# Altium project XPIRL_1V0.PrjPCB
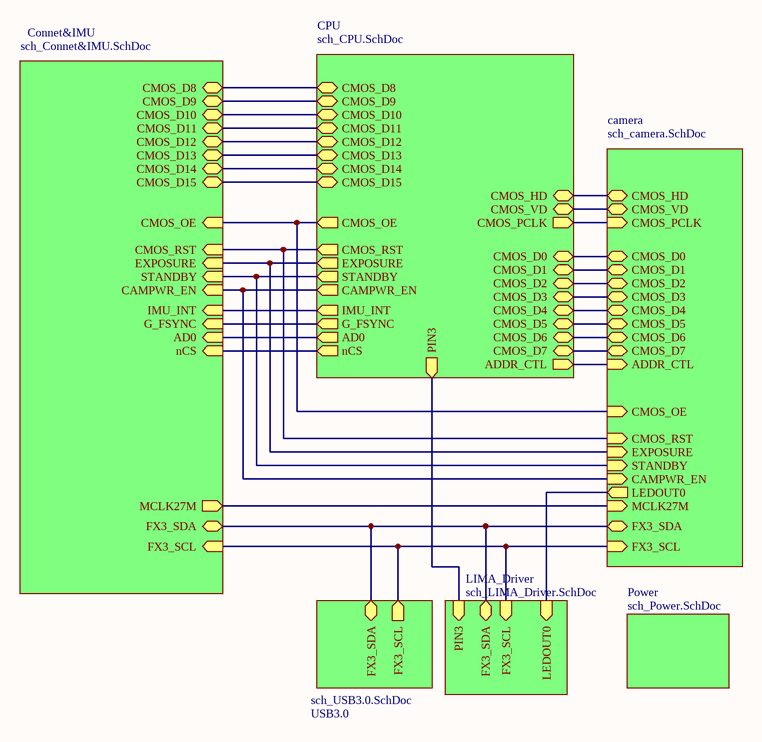
[diagram p0: sch_Top.SchDoc]
7 sheets, 227 parts. Net scope: hierarchical (ports join the sheet entries above them; power ports are global).
Sheets:
  sch_Top.SchDoc
    CPU = sch_CPU.SchDoc
    Connet&IMU = sch_Connet&IMU.SchDoc
    camera = sch_camera.SchDoc
    USB3.0 = sch_USB3.0.SchDoc
    Power = sch_Power.SchDoc
    LIMA_Driver = sch_LIMA_Driver.SchDoc

## Sheet sch_Top.SchDoc
size A4

### Sub-sheets
camera = sch_camera.SchDoc: CMOS_D0 (bidir), CMOS_D1 (bidir), CMOS_D2 (bidir), CMOS_D3 (bidir), CMOS_D4 (bidir), CMOS_D5 (bidir), CMOS_D6 (bidir), CMOS_D7 (bidir), CAMPWR_EN (in), CMOS_HD (bidir), CMOS_VD (bidir), CMOS_OE (in), CMOS_PCLK (in), CMOS_RST (in), EXPOSURE (in), STANDBY (in), ADDR_CTL (in), FX3_SCL (in), FX3_SDA (bidir), MCLK27M (in), LEDOUT0 (out)
Connet&IMU = sch_Connet&IMU.SchDoc: FX3_SCL (in), AD0 (in), nCS (in), STANDBY (in), EXPOSURE (in), CMOS_OE (in), CAMPWR_EN (in), CMOS_RST (in), FX3_SDA (bidir), CMOS_D8 (bidir), CMOS_D9 (bidir), CMOS_D10 (bidir), CMOS_D11 (bidir), CMOS_D12 (bidir), CMOS_D13 (bidir), CMOS_D14 (bidir), CMOS_D15 (bidir), IMU_INT (in), G_FSYNC (in), MCLK27M (out)
CPU = sch_CPU.SchDoc: AD0 (out), ADDR_CTL (out), CAMPWR_EN (out), CMOS_D0 (bidir), CMOS_D1 (bidir), CMOS_D2 (bidir), CMOS_D3 (bidir), CMOS_D4 (bidir), CMOS_D5 (bidir), CMOS_D6 (bidir), CMOS_D7 (bidir), CMOS_D8 (bidir), CMOS_D9 (bidir), CMOS_D10 (bidir), CMOS_D11 (bidir), CMOS_D12 (bidir), CMOS_D13 (bidir), CMOS_D14 (bidir), CMOS_D15 (bidir), CMOS_HD (bidir), CMOS_VD (bidir), CMOS_OE (out), CMOS_PCLK (out), CMOS_RST (out), EXPOSURE (out), IMU_INT (out), G_FSYNC (out), STANDBY (out), nCS (out), PIN3 (out)
LIMA_Driver = sch_LIMA_Driver.SchDoc: FX3_SDA (bidir), FX3_SCL (in), LEDOUT0 (in), PIN3 (in)
Power = sch_Power.SchDoc: no entries
USB3.0 = sch_USB3.0.SchDoc: FX3_SDA (bidir), FX3_SCL (out)

### Nets
AD0: sheet CPU/AD0, sheet Connet&IMU/AD0
ADDR_CTL: sheet CPU/ADDR_CTL, sheet camera/ADDR_CTL
CAMPWR_EN: sheet CPU/CAMPWR_EN, sheet Connet&IMU/CAMPWR_EN, sheet camera/CAMPWR_EN
CMOS_D0: sheet CPU/CMOS_D0, sheet camera/CMOS_D0
CMOS_D1: sheet CPU/CMOS_D1, sheet camera/CMOS_D1
CMOS_D2: sheet CPU/CMOS_D2, sheet camera/CMOS_D2
CMOS_D3: sheet CPU/CMOS_D3, sheet camera/CMOS_D3
CMOS_D4: sheet CPU/CMOS_D4, sheet camera/CMOS_D4
CMOS_D5: sheet CPU/CMOS_D5, sheet camera/CMOS_D5
CMOS_D6: sheet CPU/CMOS_D6, sheet camera/CMOS_D6
CMOS_D7: sheet CPU/CMOS_D7, sheet camera/CMOS_D7
CMOS_D8: sheet CPU/CMOS_D8, sheet Connet&IMU/CMOS_D8
CMOS_D9: sheet CPU/CMOS_D9, sheet Connet&IMU/CMOS_D9
CMOS_D10: sheet CPU/CMOS_D10, sheet Connet&IMU/CMOS_D10
CMOS_D11: sheet CPU/CMOS_D11, sheet Connet&IMU/CMOS_D11
CMOS_D12: sheet CPU/CMOS_D12, sheet Connet&IMU/CMOS_D12
CMOS_D13: sheet CPU/CMOS_D13, sheet Connet&IMU/CMOS_D13
CMOS_D14: sheet CPU/CMOS_D14, sheet Connet&IMU/CMOS_D14
CMOS_D15: sheet CPU/CMOS_D15, sheet Connet&IMU/CMOS_D15
CMOS_HD: sheet CPU/CMOS_HD, sheet camera/CMOS_HD
CMOS_OE: sheet CPU/CMOS_OE, sheet Connet&IMU/CMOS_OE, sheet camera/CMOS_OE
CMOS_PCLK: sheet CPU/CMOS_PCLK, sheet camera/CMOS_PCLK
CMOS_RST: sheet CPU/CMOS_RST, sheet Connet&IMU/CMOS_RST, sheet camera/CMOS_RST
CMOS_VD: sheet CPU/CMOS_VD, sheet camera/CMOS_VD
EXPOSURE: sheet CPU/EXPOSURE, sheet Connet&IMU/EXPOSURE, sheet camera/EXPOSURE
FX3_SCL: sheet Connet&IMU/FX3_SCL, sheet camera/FX3_SCL, sheet USB3.0/FX3_SCL, sheet LIMA_Driver/FX3_SCL
FX3_SDA: sheet Connet&IMU/FX3_SDA, sheet camera/FX3_SDA, sheet USB3.0/FX3_SDA, sheet LIMA_Driver/FX3_SDA
G_FSYNC: sheet CPU/G_FSYNC, sheet Connet&IMU/G_FSYNC
IMU_INT: sheet CPU/IMU_INT, sheet Connet&IMU/IMU_INT
LEDOUT0: sheet camera/LEDOUT0, sheet LIMA_Driver/LEDOUT0
MCLK27M: sheet Connet&IMU/MCLK27M, sheet camera/MCLK27M
nCS: sheet CPU/nCS, sheet Connet&IMU/nCS
PIN3: sheet CPU/PIN3, sheet LIMA_Driver/PIN3
STANDBY: sheet CPU/STANDBY, sheet Connet&IMU/STANDBY, sheet camera/STANDBY

## Sheet sch_CPU.SchDoc
size A4
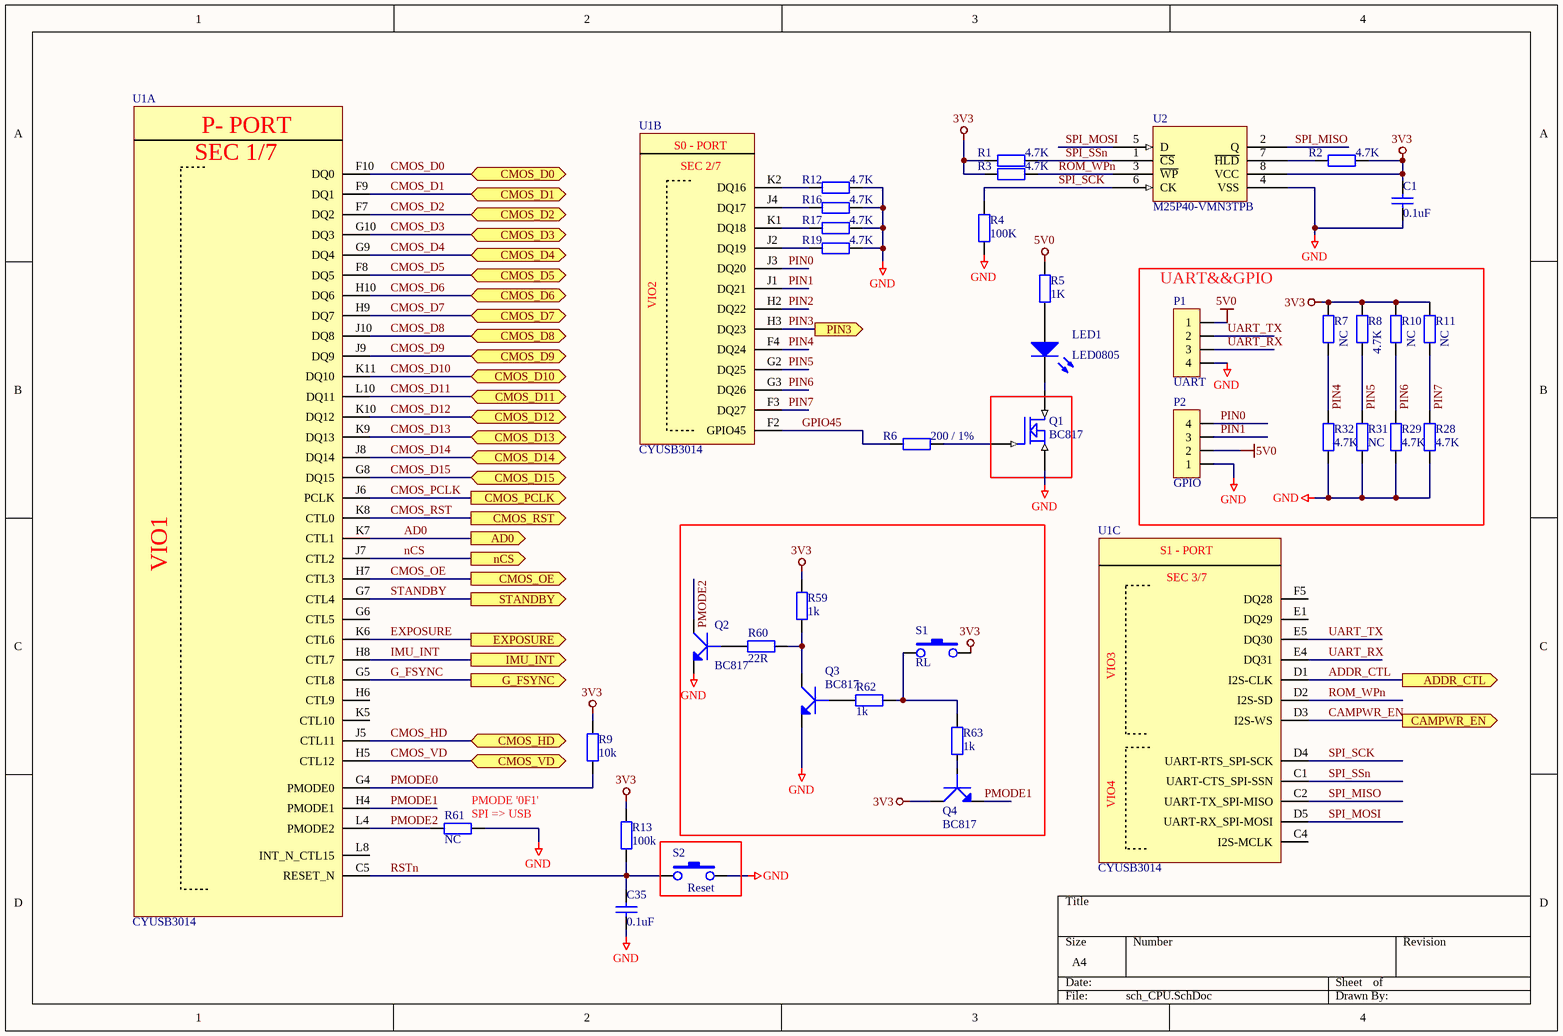
[diagram p1: sch_CPU.SchDoc]

### Parts
C1  0.1uF  [0402C]
C35  0.1uF  [0402C]
LED1  LED0805  [LED0805A_L210W100H60]
P1  UART  [WAFER4_P1.25L6.25W3.4H4.3]
P2  GPIO  [WAFER4_P1.25L6.25W3.4H4.3]
Q1  BC817  [SOT-23L]
Q2  BC817  [SOT-23L]
Q3  BC817  [SOT-23L]
Q4  BC817  [SOT-23L]
R1  4.7K  [0402R]
R2  4.7K  [0402R]
R3  4.7K  [0402R]
R4  100K  [0402R]
R5  1K  [0402R]
R6  value 200 / 1%  [0402R]  (hidden comment: 200R)
R7  NC  [0402R]
R8  4.7K  [0402R]
R9  10K  [0402R]
R10  NC  [0402R]
R11  NC  [0402R]
R12  4.7K  [0402R]
R13  100K  [0402R]
R16  4.7K  [0402R]
R17  4.7K  [0402R]
R19  4.7K  [0402R]
R28  4.7K  [0402R]
R29  4.7K  [0402R]
R31  value NC  [0402R]  (hidden comment: NC\)
R32  4.7K  [0402R]
R59  1K  [0402R]
R60  22R  [0402R]
R61  NC  [0805R]
R62  1k  [0402R]
R63  1k  [0402R]
S1  RL  [SW_L40W30H25_MPTFP]
S2  Reset  [SW_L40W30H25_MPTFP]
U1  CYUSB3014  [FBGA121_P80L100W100H11]  (parts A,B,C of 7)
U2  M25P40-VMN3TPB  [SO8N_P127L50W40W62H17]

### Blocks framed on the sheet
UART&&GPIO: P1 P2 R7 R8 R10 R11 R28 R29 R31 R32

### Ports
AD0 (out), ADDR_CTL (out), CAMPWR_EN (out), CMOS_D0 (bidir), CMOS_D1 (bidir), CMOS_D2 (bidir), CMOS_D3 (bidir), CMOS_D4 (bidir), CMOS_D5 (bidir), CMOS_D6 (bidir), CMOS_D7 (bidir), CMOS_D8 (bidir), CMOS_D9 (bidir), CMOS_D10 (bidir), CMOS_D11 (bidir), CMOS_D12 (bidir), CMOS_D13 (bidir), CMOS_D14 (bidir), CMOS_D15 (bidir), CMOS_HD (bidir), CMOS_OE (out), CMOS_PCLK (out), CMOS_RST (out), CMOS_VD (bidir), EXPOSURE (out), G_FSYNC (out), IMU_INT (out), nCS (out), PIN3 (out), STANDBY (out)

### Nets
3V3: C1.2 Q4.3(C) R1.1 R2.2 R3.1 R7.2 R8.2 R9.1 R10.2 R11.2 R13.1 R59.2 S1.1 U2.8(VCC)
5V0: P1.1 P2.2 R5.1
GND: C1.1 C35.1 P1.4 P2.1 Q1.2(S) Q2.2(E) Q3.2(E) R4.1 R12.2 R16.2 R17.2 R19.2 R28.2 R29.2 R31.2 R32.2 R61.1 S2.2 U2.4(VSS)
AD0: U1.K7(CTL1) ; port AD0
ADDR_CTL: U1.D1(I2S-CLK) ; port ADDR_CTL
CAMPWR_EN: U1.D3(I2S-WS) ; port CAMPWR_EN
CMOS_D0: U1.F10(DQ0) ; port CMOS_D0
CMOS_D1: U1.F9(DQ1) ; port CMOS_D1
CMOS_D2: U1.F7(DQ2) ; port CMOS_D2
CMOS_D3: U1.G10(DQ3) ; port CMOS_D3
CMOS_D4: U1.G9(DQ4) ; port CMOS_D4
CMOS_D5: U1.F8(DQ5) ; port CMOS_D5
CMOS_D6: U1.H10(DQ6) ; port CMOS_D6
CMOS_D7: U1.H9(DQ7) ; port CMOS_D7
CMOS_D8: U1.J10(DQ8) ; port CMOS_D8
CMOS_D9: U1.J9(DQ9) ; port CMOS_D9
CMOS_D10: U1.K11(DQ10) ; port CMOS_D10
CMOS_D11: U1.L10(DQ11) ; port CMOS_D11
CMOS_D12: U1.K10(DQ12) ; port CMOS_D12
CMOS_D13: U1.K9(DQ13) ; port CMOS_D13
CMOS_D14: U1.J8(DQ14) ; port CMOS_D14
CMOS_D15: U1.G8(DQ15) ; port CMOS_D15
CMOS_HD: U1.J5(CTL11) ; port CMOS_HD
CMOS_OE: U1.H7(CTL3) ; port CMOS_OE
CMOS_PCLK: U1.J6(PCLK) ; port CMOS_PCLK
CMOS_RST: U1.K8(CTL0) ; port CMOS_RST
CMOS_VD: U1.H5(CTL12) ; port CMOS_VD
EXPOSURE: U1.K6(CTL6) ; port EXPOSURE
G_FSYNC: U1.G5(CTL8) ; port G_FSYNC
GPIO45: R6.1 U1.F2(GPIO45)
IMU_INT: U1.H8(CTL7) ; port IMU_INT
nCS: U1.J7(CTL2) ; port nCS
PIN0: P2.4 U1.J3(DQ20)
PIN1: P2.3 U1.J1(DQ21)
PIN2: U1.H2(DQ22)
PIN3: U1.H3(DQ23) ; port PIN3
PIN4: R7.1 R32.1 U1.F4(DQ24)
PIN5: R8.1 R31.1 U1.G2(DQ25)
PIN6: R10.1 R29.1 U1.G3(DQ26)
PIN7: R11.1 R28.1 U1.F3(DQ27)
PMODE0: R9.2 U1.G4(PMODE0)
PMODE1: Q4.2(E) U1.H4(PMODE1)
PMODE2: Q2.3(C) R61.2 U1.L4(PMODE2)
ROM_WPn: R3.2 U1.D2(I2S-SD) U2.3(~{WP})
RSTn: C35.2 R13.2 S2.1 U1.C5(RESET_N)
SPI_MISO: U1.C2(UART-TX_SPI-MISO) U2.2(Q)
SPI_MOSI: U1.D5(UART-RX_SPI-MOSI) U2.5(D)
SPI_SCK: R4.2 U1.D4(UART-RTS_SPI-SCK) U2.6(CK)
SPI_SSn: R1.2 U1.C1(UART-CTS_SPI-SSN) U2.1(~{CS})
STANDBY: U1.G7(CTL4) ; port STANDBY
UART_RX: P1.3 U1.E4(DQ31)
UART_TX: P1.2 U1.E5(DQ30)
NetLED1_1: LED1.1(A) R5.2
NetLED1_2: LED1.2(K) Q1.3(D)
NetQ1_1: Q1.1(G) R6.2
NetQ2_1: Q2.1(B) R60.1
NetQ3_1: Q3.1(B) R62.2
NetQ3_3: Q3.3(C) R59.1 R60.2
NetQ4_1: Q4.1(B) R63.2
NetR2_1: R2.1 U2.7(~{HLD})
NetR12_1: R12.1 U1.K2(DQ16)
NetR16_1: R16.1 U1.J4(DQ17)
NetR17_1: R17.1 U1.K1(DQ18)
NetR19_1: R19.1 U1.J2(DQ19)
NetR62_1: R62.1 R63.1 S1.2

Not connected (* = marked no-connect by the designer): U1 C4(I2S-MCLK) E1(DQ29) F5(DQ28) G6(CTL5) H6(CTL9) K5(CTL10) L8(INT_N_CTL15)

### Notes on the sheet
- (near R61) PMODE '0F1'
- (near R61) SPI => USB
- (in symbol CYUSB3014, part A) P- PORT; SEC 1/7; VIO1
- (in symbol CYUSB3014, part B) S0 - PORT; SEC 2/7
- (in symbol CYUSB3014, part C) S1 - PORT; SEC 3/7

### Library data of the parts
C1 C35 = Cap: Capacitor; Published: 8-Jun-2000; LatestRevisionDate: 17-Jul-2002; LatestRevisionNote: Re-released for DXP Platform.; PackageReference: RAD-0.3; Publisher: Altium Limited; Value: 0.1uF
LED1 = LED: 发光二级管
P1 P2 = CON4
Q1 = MOSFET N
Q2-Q4 = NPN: NPN Transistor
R1-R13 R16 R17 R19 R28 R29 R31 R32 R59 R61-R63 = Resistor: Published: 8-Jun-2000; LatestRevisionDate: 17-Jul-2002; LatestRevisionNote: Re-released for DXP Platform.; PackageReference: AXIAL-0.4; Publisher: Altium Limited
  R1-R3 R8 R12 R16 R17 R19 R28 R29 R32: Value: 4.7K
  R4: Value: 100K
  R5: Value: 1K
  R7 R10 R11 R61: Value: NC
  R9: Value: 10k
  R13: Value: 100k
  R59 R62 R63: Value: 1k
R60 = Resistor: Value: 10k; Published: 8-Jun-2000; LatestRevisionDate: 17-Jul-2002; LatestRevisionNote: Re-released for DXP Platform.; PackageReference: AXIAL-0.4; Publisher: Altium Limited
S1 S2 = Button_sop: Value: BUTTON

## Sheet sch_Connet&IMU.SchDoc
size A4
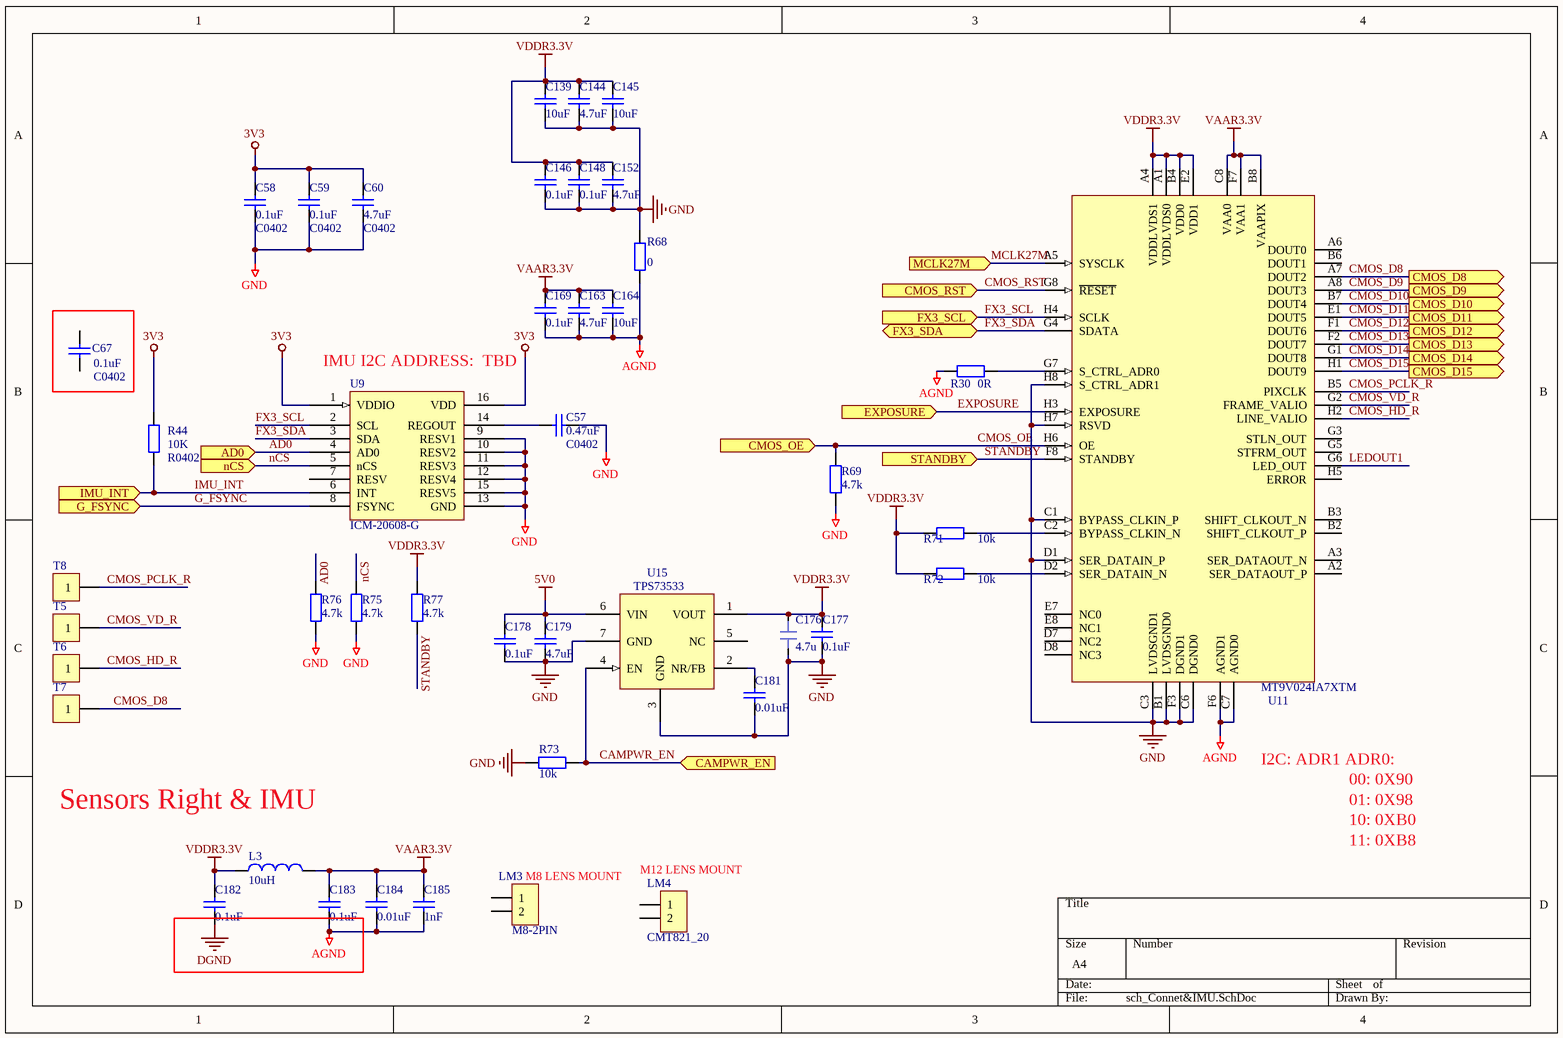
[diagram p2: sch_Connet&IMU.SchDoc]

### Parts
C57  0.47uF  value C0402  [0402C]
C58  0.1uF  value C0402  [0402C]
C59  0.1uF  value C0402  [0402C]
C60  4.7uF  value C0402  [0402C]
C67  0.1uF  value C0402  [0402C]
C139  10uF  [0805C]
C144  4.7uF  [0402C]
C145  10uF  [0805C]
C146  0.1uF  [0402C]
C148  0.1uF  [0402C]
C152  4.7uF  [0402C]
C163  4.7uF  [0402C]
C164  10uF  [0805C]
C169  0.1uF  [0402C]
C176  4.7u  [0402C_L]
C177  0.1uF  [0402C_L]
C178  0.1uF  [0402C]
C179  4.7uF  [0402C_L]
C181  0.01uF  [0402C_L]
C182  0.1uF  [0402C_L]
C183  0.1uF  [0402C_L]
C184  0.01uF  [0402C_L]
C185  1nF  [0402C_L]
L3  10uH  [0805R]
LM3  M8-2PIN  [PAD_M3_D350_450]
LM4  CMT821_20  [PAD_M3_D350_450]
R30  0R  [0402R]
R44  10K  value R0402  [0402R]
R68  value 0  [0402R]  (hidden comment: 0R)
R69  4.7K  [0402R_L]
R71  10K  [0402R]
R72  10K  [0402R]
R73  10K  [0402R_L]
R75  4.7K  [0402R]
R76  4.7K  [0402R]
R77  4.7K  [0402R]
T5  CON1  [PAD_TP_D1.2]  (value not drawn)
T6  CON1  [PAD_TP_D1.2]  (value not drawn)
T7  CON1  [PAD_TP_D1.2]  (value not drawn)
T8  CON1  [PAD_TP_D1.2]  (value not drawn)
U9  ICM-20608-G  [LGA16_P50L30W30H08]
U11  MT9V024IA7XTM  [IBGA52_8X8_P100L90W90H90R]
U15  TPS73533  [SON6_P65L21W21H8_DRV]

### Ports
AD0 (in), CAMPWR_EN (in), CMOS_D8 (out), CMOS_D9 (out), CMOS_D10 (out), CMOS_D11 (out), CMOS_D12 (out), CMOS_D13 (out), CMOS_D14 (out), CMOS_D15 (out), CMOS_OE (in), CMOS_RST (in), EXPOSURE (in), FX3_SCL (in), FX3_SDA (bidir), G_FSYNC (in), IMU_INT (in), MCLK27M (in), nCS (in), STANDBY (in)

### Nets
3V3: C58.2 C59.2 C60.2 R44.2 U9.1(VDDIO) U9.16(VDD)
5V0: C178.2 C179.2 U15.6(VIN)
AGND: C163.1 C164.1 C169.1 C183.1 C184.1 C185.1 R30.2 R68.2 U11.C7(AGND0) U11.F6(AGND1)
DGND: C182.1
GND: C57.1 C58.1 C59.1 C60.1 C139.1 C144.1 C145.1 C146.1 C148.1 C152.1 C176.2 C177.1 C178.1 C179.1 C181.1 R68.1 R69.1 R73.1 R75.1 R76.1 U9.9(RESV1) U9.10(RESV2) U9.11(RESV3) U9.12(RESV4) U9.13(GND) U9.15(RESV5) U11.B1(LVDSGND0) U11.C1(BYPASS_CLKIN_P) U11.C3(LVDSGND1) U11.C6(DGND0) U11.D1(SER_DATAIN_P) U11.F3(DGND1) U11.H7(RSVD) U11.H8(S_CTRL_ADR1) U15.3(GND) U15.7(GND)
VAAR3.3V: C163.2 C164.2 C169.2 C183.2 C184.2 C185.2 L3.2 U11.B8(VAAPIX) U11.C8(VAA0) U11.F7(VAA1)
VDDR3.3V: C139.2 C144.2 C145.2 C146.2 C148.2 C152.2 C176.1 C177.2 C182.2 L3.1 R71.2 R72.2 R77.2 U11.A1(VDDLVDS0) U11.A4(VDDLVDS1) U11.B4(VDD0) U11.E2(VDD1) U15.1(VOUT)
AD0: R76.2 U9.4(AD0) ; port AD0
CAMPWR_EN: R73.2 U15.4(EN) ; port CAMPWR_EN
CMOS_D8: T7.1 U11.A7(DOUT2) ; port CMOS_D8
CMOS_D9: U11.A8(DOUT3) ; port CMOS_D9
CMOS_D10: U11.B7(DOUT4) ; port CMOS_D10
CMOS_D11: U11.E1(DOUT5) ; port CMOS_D11
CMOS_D12: U11.F1(DOUT6) ; port CMOS_D12
CMOS_D13: U11.F2(DOUT7) ; port CMOS_D13
CMOS_D14: U11.G1(DOUT8) ; port CMOS_D14
CMOS_D15: U11.H1(DOUT9) ; port CMOS_D15
CMOS_HD_R: T6.1 U11.H2(LINE_VALIO)
CMOS_OE: R69.2 U11.H6(OE) ; port CMOS_OE
CMOS_PCLK_R: T8.1 U11.B5(PIXCLK)
CMOS_RST: U11.G8(~{RESET}) ; port CMOS_RST
CMOS_VD_R: T5.1 U11.G2(FRAME_VALIO)
EXPOSURE: U11.H3(EXPOSURE) ; port EXPOSURE
FX3_SCL: U9.2(SCL) U11.H4(SCLK) ; port FX3_SCL
FX3_SDA: U9.3(SDA) U11.G4(SDATA) ; port FX3_SDA
G_FSYNC: U9.8(FSYNC) ; port G_FSYNC
IMU_INT: R44.1 U9.6(INT) ; port IMU_INT
LEDOUT1: U11.G6(LED_OUT)
MCLK27M: U11.A5(SYSCLK) ; port MCLK27M
nCS: R75.2 U9.5(nCS) ; port nCS
STANDBY: R77.1 U11.F8(STANDBY) ; port STANDBY
NetC57_2: C57.2 U9.14(REGOUT)
NetC181_2: C181.2 U15.2(NR/FB)
NetR30_1: R30.1 U11.G7(S_CTRL_ADR0)
NetR71_1: R71.1 U11.C2(BYPASS_CLKIN_N)
NetR72_1: R72.1 U11.D2(SER_DATAIN_N)

Not connected (* = marked no-connect by the designer): C67 1 2; LM3 1 2; LM4 1 2; U9 7(RESV); U11 A2(SER_DATAOUT_P) A3(SER_DATAOUT_N) A6(DOUT0) B2(SHIFT_CLKOUT_P) B3(SHIFT_CLKOUT_N) B6(DOUT1) D7(NC2) D8(NC3) E7(NC0) E8(NC1) G3(STLN_OUT) G5(STFRM_OUT) H5(ERROR); U15 5(NC)

### Notes on the sheet
- (near U9) IMU I2C ADDRESS:  TBD
- I2C: ADR1 ADR0:
- 00: 0X90
- Sensors Right & IMU
- 01: 0X98
- 10: 0XB0
- 11: 0XB8
- (near LM3) M8 LENS MOUNT
- (near LM4) M12 LENS MOUNT

### Library data of the parts
C57-C60 C67 C139 C144-C146 C148 C152 C163 C164 C169 C177-C179 C181-C185 = Cap: Capacitor; Published: 8-Jun-2000; LatestRevisionDate: 17-Jul-2002; LatestRevisionNote: Re-released for DXP Platform.; Publisher: Altium Limited
  C57-C60 C67: PackageReference: RAD-0.3
  C139 C145 C164: PackageReference: RAD-0.3; Value: 10uF
  C144 C152 C163 C179: PackageReference: RAD-0.3; Value: 4.7uF
  C146 C148 C169 C177 C178 C182 C183: Value: 0.1uF
  C181: PackageReference: RAD-0.3; Value: 0.01uF
  C184: Value: 0.01uF
  C185: Value: 1nF
C176 = cap0402: CC0402MRX5R5BB475; 元件类别: 贴片电容; 主物料厂家: YAGEO
L3 = Inductor: Value: 330mH
LM3 LM4 = CON2: Connector
R30 R44 = Res2: Resistor; Published: 8-Jun-2000; LatestRevisionDate: 17-Jul-2002; LatestRevisionNote: Re-released for DXP Platform.; PackageReference: AXIAL-0.4; Publisher: Altium Limited
  R30: Value: 0R
R68 R69 R71-R73 R75-R77 = Resistor: Published: 8-Jun-2000; LatestRevisionDate: 17-Jul-2002; LatestRevisionNote: Re-released for DXP Platform.; PackageReference: AXIAL-0.4; Publisher: Altium Limited
  R69 R75-R77: Value: 4.7k
  R71-R73: Value: 10k
T5-T8 = CON1: Connector

## Sheet sch_camera.SchDoc
size A4
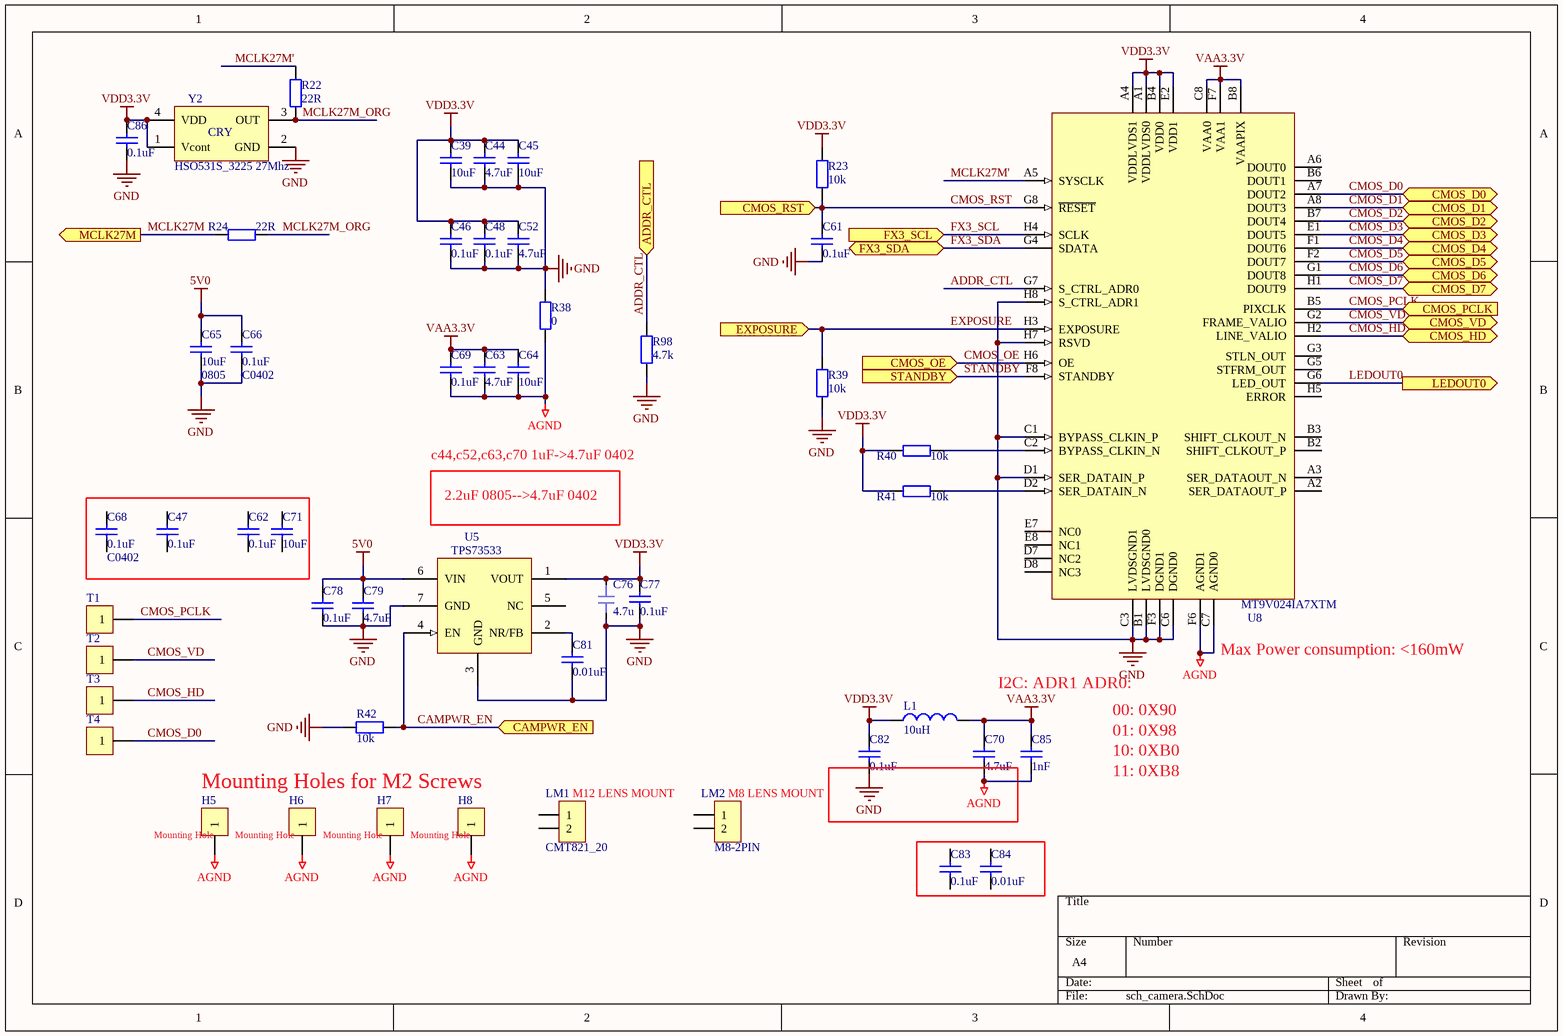
[diagram p3: sch_camera.SchDoc]

### Parts
C39  10uF  [0805C]
C44  4.7uF  [0402C]
C45  10uF  [0805C]
C46  0.1uF  [0402C]
C47  0.1uF  [0402C]
C48  0.1uF  [0402C]
C52  4.7uF  [0402C]
C61  0.1uF  [0402C_L]
C62  0.1uF  [0402C]
C63  4.7uF  [0402C]
C64  10uF  [0805C]
C65  10uF  value 0805  [0805C]
C66  0.1uF  value C0402  [0402C]
C68  0.1uF  value C0402  [0402C]
C69  0.1uF  [0402C]
C70  4.7uF  [0402C]
C71  10uF  [0805C]
C76  4.7u  [0402C_L]
C77  0.1uF  [0402C_L]
C78  0.1uF  [0402C]
C79  value 4.7uF  [0402C_L]  (hidden comment: 1uF)
C81  0.01uF  [0402C_L]
C82  0.1uF  [0402C_L]
C83  0.1uF  [0402C_L]
C84  0.01uF  [0402C_L]
C85  1nF  [0402C_L]
C86  0.1uF  [0402C_L]
H5  CON1  [PAD_M3_D350_450]  (value not drawn)
H6  CON1  [PAD_M3_D350_450]  (value not drawn)
H7  CON1  [PAD_M3_D350_450]  (value not drawn)
H8  CON1  [PAD_M3_D350_450]  (value not drawn)
L1  10uH  [0805R]
LM1  CMT821_20  [PAD_M3_D350_450]
LM2  M8-2PIN  [PAD_M3_D350_450]
R22  value 22R  [0402R_L]  (hidden comment: 0R)
R23  10K  [0402R_L]
R24  22R  [0402R]
R38  value 0  [0402R]  (hidden comment: 0R)
R39  10K  [0402R_L]
R40  10K  [0402R_L]
R41  10K  [0402R_L]
R42  10K  [0402R_L]
R98  4.7K  [0402R_L]
T1  CON1  [PAD_TP_D1.2]  (value not drawn)
T2  CON1  [PAD_TP_D1.2]  (value not drawn)
T3  CON1  [PAD_TP_D1.2]  (value not drawn)
T4  CON1  [PAD_TP_D1.2]  (value not drawn)
U5  TPS73533  [SON6_P65L21W21H8_DRV]
U8  MT9V024IA7XTM  [IBGA52_8X8_P100L90W90H90R]
Y2  HSO531S_3225 27Mhz  [XTAL_3225]

### Ports
ADDR_CTL (in), CAMPWR_EN (in), CMOS_D0 (bidir), CMOS_D1 (bidir), CMOS_D2 (bidir), CMOS_D3 (bidir), CMOS_D4 (bidir), CMOS_D5 (bidir), CMOS_D6 (bidir), CMOS_D7 (bidir), CMOS_HD (bidir), CMOS_OE (in), CMOS_PCLK (in), CMOS_RST (in), CMOS_VD (bidir), EXPOSURE (in), FX3_SCL (in), FX3_SDA (bidir), LEDOUT0 (out), MCLK27M (out), STANDBY (in)

### Nets
5V0: C65.2 C66.2 C78.2 C79.2 U5.6(VIN)
AGND: C63.1 C64.1 C69.1 C70.1 C85.1 H5.1 H6.1 H7.1 H8.1 R38.2 U8.C7(AGND0) U8.F6(AGND1)
GND: C39.1 C44.1 C45.1 C46.1 C48.1 C52.1 C61.1 C65.1 C66.1 C76.2 C77.1 C78.1 C79.1 C81.1 C82.1 C86.1 R38.1 R39.2 R42.2 R98.1 U5.3(GND) U5.7(GND) U8.B1(LVDSGND0) U8.C1(BYPASS_CLKIN_P) U8.C3(LVDSGND1) U8.C6(DGND0) U8.D1(SER_DATAIN_P) U8.F3(DGND1) U8.H7(RSVD) U8.H8(S_CTRL_ADR1) Y2.2(GND)
VAA3.3V: C63.2 C64.2 C69.2 C70.2 C85.2 L1.2 U8.B8(VAAPIX) U8.C8(VAA0) U8.F7(VAA1)
VDD3.3V: C39.2 C44.2 C45.2 C46.2 C48.2 C52.2 C76.1 C77.2 C82.2 C86.2 L1.1 R23.2 R40.2 R41.2 U5.1(VOUT) U8.A1(VDDLVDS0) U8.A4(VDDLVDS1) U8.B4(VDD0) U8.E2(VDD1) Y2.1(Vcont) Y2.4(VDD)
ADDR_CTL: R98.2 U8.G7(S_CTRL_ADR0) ; port ADDR_CTL
CAMPWR_EN: R42.1 U5.4(EN) ; port CAMPWR_EN
CMOS_D0: T4.1 U8.A7(DOUT2) ; port CMOS_D0
CMOS_D1: U8.A8(DOUT3) ; port CMOS_D1
CMOS_D2: U8.B7(DOUT4) ; port CMOS_D2
CMOS_D3: U8.E1(DOUT5) ; port CMOS_D3
CMOS_D4: U8.F1(DOUT6) ; port CMOS_D4
CMOS_D5: U8.F2(DOUT7) ; port CMOS_D5
CMOS_D6: U8.G1(DOUT8) ; port CMOS_D6
CMOS_D7: U8.H1(DOUT9) ; port CMOS_D7
CMOS_HD: T3.1 U8.H2(LINE_VALIO) ; port CMOS_HD
CMOS_OE: U8.H6(OE) ; port CMOS_OE
CMOS_PCLK: T1.1 U8.B5(PIXCLK) ; port CMOS_PCLK
CMOS_RST: C61.2 R23.1 U8.G8(~{RESET}) ; port CMOS_RST
CMOS_VD: T2.1 U8.G2(FRAME_VALIO) ; port CMOS_VD
EXPOSURE: R39.1 U8.H3(EXPOSURE) ; port EXPOSURE
FX3_SCL: U8.H4(SCLK) ; port FX3_SCL
FX3_SDA: U8.G4(SDATA) ; port FX3_SDA
LEDOUT0: U8.G6(LED_OUT) ; port LEDOUT0
MCLK27M: R24.1 ; port MCLK27M
MCLK27M': R22.1 U8.A5(SYSCLK)
MCLK27M_ORG: R22.2 R24.2 Y2.3(OUT)
STANDBY: U8.F8(STANDBY) ; port STANDBY
NetC81_2: C81.2 U5.2(NR/FB)
NetR40_1: R40.1 U8.C2(BYPASS_CLKIN_N)
NetR41_1: R41.1 U8.D2(SER_DATAIN_N)

Not connected (* = marked no-connect by the designer): C47 1 2; C62 1 2; C68 1 2; C71 1 2; C83 1 2; C84 1 2; LM1 1 2; LM2 1 2; U5 5(NC); U8 A2(SER_DATAOUT_P) A3(SER_DATAOUT_N) A6(DOUT0) B2(SHIFT_CLKOUT_P) B3(SHIFT_CLKOUT_N) B6(DOUT1) D7(NC2) D8(NC3) E7(NC0) E8(NC1) G3(STLN_OUT) G5(STFRM_OUT) H5(ERROR)

### Notes on the sheet
- c44,c52,c63,c70 1uF->4.7uF 0402
- 2.2uF 0805-->4.7uF 0402
- (near U8) Max Power consumption: <160mW
- I2C: ADR1 ADR0:
- 00: 0X90
- Mounting Holes for M2 Screws
- 01: 0X98
- 10: 0XB0
- 11: 0XB8
- (near H5) Mounting Hole
- (near H6) Mounting Hole
- (near H7) Mounting Hole
- (near H8) Mounting Hole
- (near LM1) M12 LENS MOUNT
- (near LM2) M8 LENS MOUNT

### Library data of the parts
C39 C44-C48 C52 C61-C66 C68-C71 C77-C79 C81-C86 = Cap: Capacitor; Published: 8-Jun-2000; LatestRevisionDate: 17-Jul-2002; LatestRevisionNote: Re-released for DXP Platform.; Publisher: Altium Limited
  C39 C45 C64 C71: PackageReference: RAD-0.3; Value: 10uF
  C44 C52 C63 C70: PackageReference: RAD-0.3; Value: 4.7uF
  C46-C48 C61 C62 C69 C77 C78 C82 C83 C86: Value: 0.1uF
  C65 C79: PackageReference: RAD-0.3
  C81: PackageReference: RAD-0.3; Value: 0.01uF
  C84: Value: 0.01uF
  C85: Value: 1nF
C76 = cap0402: as C176 on sheet sch_Connet&IMU
H5-H8 T1-T4 = CON1: Connector
L1 = Inductor: Value: 330mH
LM1 LM2 = CON2: Connector
R22-R24 R38-R42 R98 = Resistor: Published: 8-Jun-2000; LatestRevisionDate: 17-Jul-2002; LatestRevisionNote: Re-released for DXP Platform.; PackageReference: AXIAL-0.4; Publisher: Altium Limited
  R23 R39-R42: Value: 10k
  R24: Value: 22R
  R98: Value: 4.7k
Y2 = CRY: 有源晶振

## Sheet sch_USB3.0.SchDoc
size A4
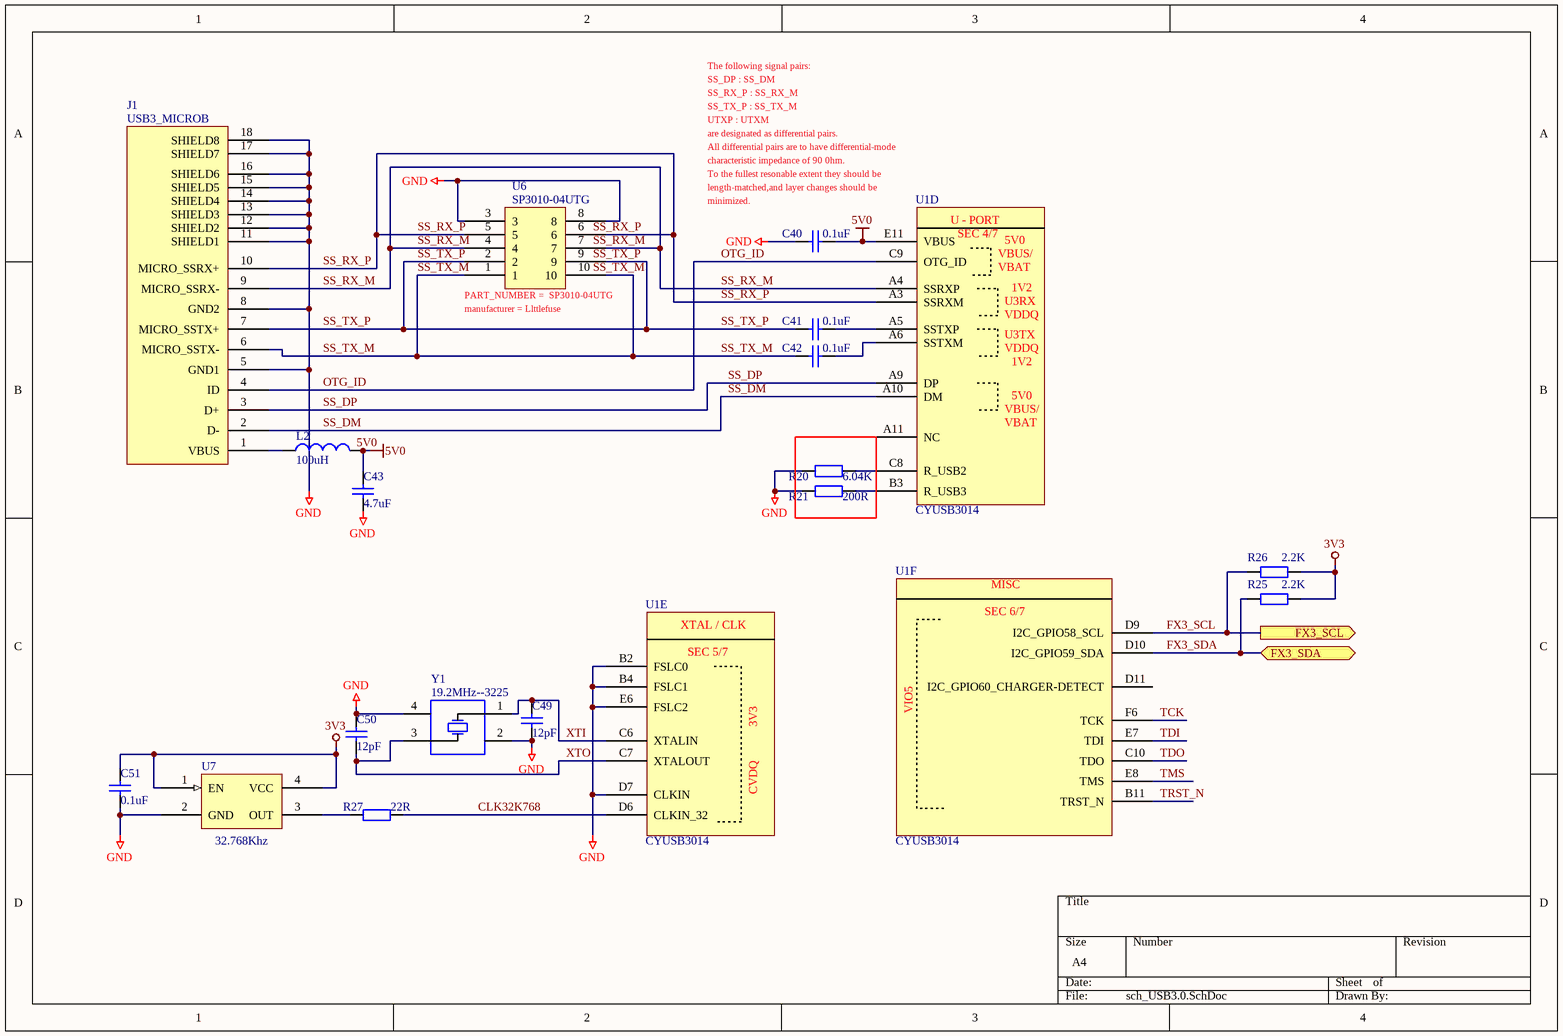
[diagram p4: sch_USB3.0.SchDoc]

### Parts
C40  0.1uF  [0402C]
C41  0.1uF  [0402C]
C42  0.1uF  [0402C]
C43  4.7uF
C49  12pF  [0402C]
C50  12pF  [0402C]
C51  0.1uF  [0402C]
J1  USB3_MICROB  [USB3_BA_P65L130W51H28]
L2  100uH
R20  6.04K  [0402R]
R21  200R  [0402R]
R25  2.2K  [0402R]
R26  2.2K  [0402R]
R27  22R  [0402R]
U1  CYUSB3014  [FBGA121_P80L100W100H11]  (parts D,E,F of 7)
U6  SP3010-04UTG  [UDFN10_SON_P50L25W10H55]
U7  XTAL-3225  [XTAL_3225]  (value not drawn)
Y1  19.2MHz--3225  [XTAL_3225]

### Ports
FX3_SCL (out), FX3_SDA (bidir)

### Nets
3V3: C51.2 R25.1 R26.1 U7.1(EN) U7.4(VCC)
5V0: C40.1 C43.2 L2.2 U1.E11(VBUS)
GND: C40.2 C43.1 C49.1 C50.2 C51.1 J1.5(GND1) J1.8(GND2) J1.11(SHIELD1) J1.12(SHIELD2) J1.13(SHIELD3) J1.14(SHIELD4) J1.15(SHIELD5) J1.16(SHIELD6) J1.17(SHIELD7) J1.18(SHIELD8) R20.2 R21.2 U1.B2(FSLC0) U1.B4(FSLC1) U1.D7(CLKIN) U1.E6(FSLC2) U6.3 U6.8 U7.2(GND) Y1.2 Y1.4
CLK32K768: R27.1 U1.D6(CLKIN_32)
FX3_SCL: R26.2 U1.D9(I2C_GPIO58_SCL) ; port FX3_SCL
FX3_SDA: R25.2 U1.D10(I2C_GPIO59_SDA) ; port FX3_SDA
OTG_ID: J1.4(ID) U1.C9(OTG_ID)
SS_DM: J1.2(D-) U1.A10(DM)
SS_DP: J1.3(D+) U1.A9(DP)
SS_RX_M: J1.9(MICRO_SSRX-) U1.A4(SSRXP) U6.4 U6.7
SS_RX_P: J1.10(MICRO_SSRX+) U1.A3(SSRXM) U6.5 U6.6
SS_TX_M: C42.2 J1.6(MICRO_SSTX-) U6.1 U6.10
SS_TX_P: C41.2 J1.7(MICRO_SSTX+) U6.2 U6.9
TCK: U1.F6(TCK)
TDI: U1.E7(TDI)
TDO: U1.C10(TDO)
TMS: U1.E8(TMS)
TRST_N: U1.B11(TRST_N)
XTI: C49.2 U1.C6(XTALIN) Y1.1
XTO: C50.1 U1.C7(XTALOUT) Y1.3
NetC41_1: C41.1 U1.A5(SSTXP)
NetC42_1: C42.1 U1.A6(SSTXM)
NetJ1_1: J1.1(VBUS) L2.1
NetR20_1: R20.1 U1.C8(R_USB2)
NetR21_1: R21.1 U1.B3(R_USB3)
NetR27_2: R27.2 U7.3(OUT)

Not connected (* = marked no-connect by the designer): U1 A11(NC) D11(I2C_GPIO60_CHARGER-DETECT)

### Notes on the sheet
- The following signal pairs:
- SS_DP : SS_DM
- SS_RX_P : SS_RX_M
- SS_TX_P : SS_TX_M
- UTXP : UTXM
- are designated as differential pairs.
- All differential pairs are to have differential-mode
- characteristic impedance of 90 0hm.
- To the fullest resonable extent they should be
- length-matched,and layer changes should be
- minimized.
- (near U6) PART_NUMBER =  SP3010-04UTG
- (near U6) manufacturer = Llttlefuse
- (near U7) 32.768Khz
- Labels drawn without touching a wire or pin: 5V0, SS_RX_M, SS_RX_P, SS_TX_M, SS_TX_P
- (in symbol CYUSB3014, part D) U - PORT; SEC 4/7; 5V0; VBUS/; 1V2; U3RX; VDDQ; U3TX
- (in symbol CYUSB3014, part E) XTAL / CLK; SEC 5/7; 3V3; CVDQ
- (in symbol CYUSB3014, part F) MISC; SEC 6/7

### Library data of the parts
C40-C43 C49-C51 = Cap: Capacitor; Published: 8-Jun-2000; LatestRevisionDate: 17-Jul-2002; LatestRevisionNote: Re-released for DXP Platform.; PackageReference: RAD-0.3; Publisher: Altium Limited
  C40-C42 C51: Value: 0.1uF
  C43: Value: 4.7uF
L2 = Inductor: Value: 330mH
R20 = Resistor: Value: 43; Published: 8-Jun-2000; LatestRevisionDate: 17-Jul-2002; LatestRevisionNote: Re-released for DXP Platform.; PackageReference: AXIAL-0.4; Publisher: Altium Limited
R21 R25-R27 = Resistor: Published: 8-Jun-2000; LatestRevisionDate: 17-Jul-2002; LatestRevisionNote: Re-released for DXP Platform.; PackageReference: AXIAL-0.4; Publisher: Altium Limited
U7 = XTAL.
Y1 = XTAL: Crystal Oscillator

## Sheet sch_Power.SchDoc
size A4
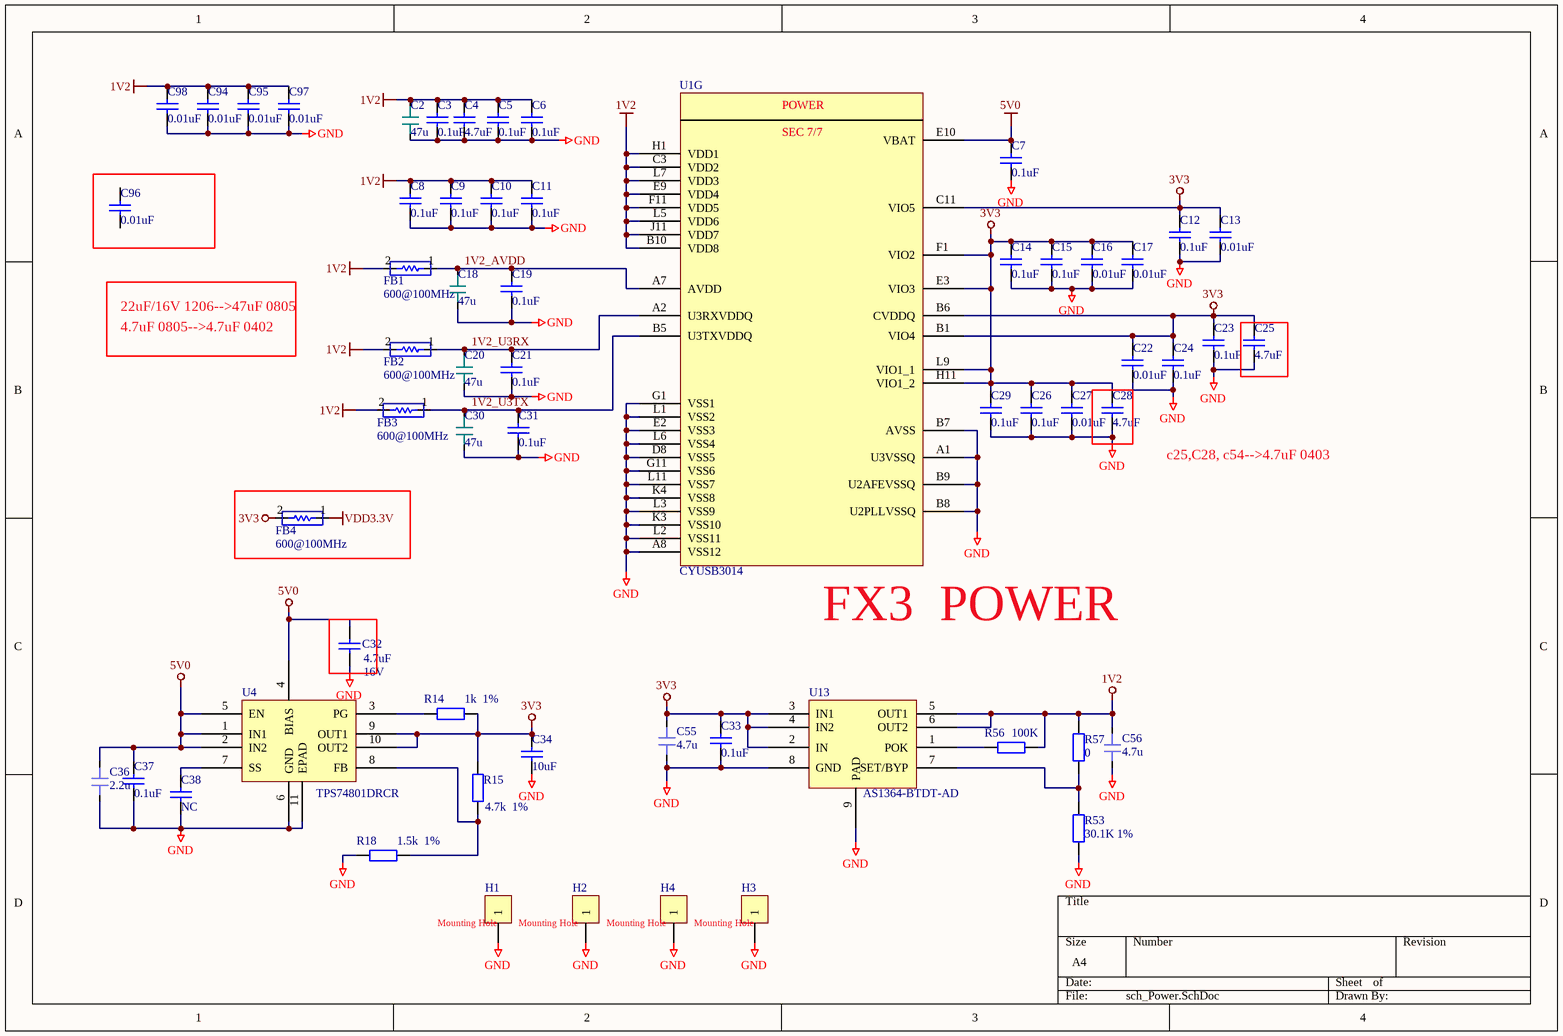
[diagram p5: sch_Power.SchDoc]

### Parts
C2  47u  [0805C]
C3  0.1uF  [0402C]
C4  value 4.7uF  [0402C]  (hidden comment: 0.1uF)
C5  0.1uF  [0402C]
C6  0.1uF  [0402C]
C7  0.1uF  [0402C]
C8  0.1uF  [0402C]
C9  0.1uF  [0402C]
C10  0.1uF  [0402C]
C11  0.1uF  [0402C]
C12  0.1uF  [0402C]
C13  0.01uF  [0402C]
C14  0.1uF  [0402C]
C15  0.1uF  [0402C]
C16  0.01uF  [0402C]
C17  0.01uF  [0402C]
C18  47u  [0805C]
C19  0.1uF  [0402C]
C20  47u  [0805C]
C21  0.1uF  [0402C]
C22  0.01uF  [0402C]
C23  0.1uF  [0402C]
C24  0.1uF  [0402C]
C25  4.7uF  [0402C]
C26  0.1uF  [0402C]
C27  0.01uF  [0402C]
C28  4.7uF  [0402C]
C29  0.1uF  [0402C]
C30  47u  [0805C]
C31  0.1uF  [0402C]
C32  4.7uF  value 16V  [0402C]
C33  0.1uF  [0402C]
C34  10uF  [0805C]
C36  2.2u  [0402C]
C37  0.1uF  [0402C]
C38  NC  [0402C]
C55  4.7u  [0402C]
C56  4.7u  [0402C]
C94  0.01uF  [0402C]
C95  0.01uF  [0402C]
C96  0.01uF  [0402C]
C97  0.01uF  [0402C]
C98  0.01uF  [0402C]
FB1  600@100MHz  [0603R]
FB2  600@100MHz  [0603R]
FB3  600@100MHz  [0603R]
FB4  600@100MHz  [0603R]
H1  CON1  [PAD_M3_D350_450]  (value not drawn)
H2  CON1  [PAD_M3_D350_450]  (value not drawn)
H3  CON1  [PAD_M3_D350_450]  (value not drawn)
H4  CON1  [PAD_M3_D350_450]  (value not drawn)
R14  value 1k  1%  [0402R]  (hidden comment: 1K)
R15  value 4.7k  1%  [0402R]  (hidden comment: 4.7K)
R18  value 1.5k  1%  [0402R]  (hidden comment: 1.5K)
R53  value 30.1K 1%  [0402R]  (hidden comment: 30.1K)
R56  100K  [0402R]
R57  value 0  [0402R]  (hidden comment: 0R)
U1  CYUSB3014  [FBGA121_P80L100W100H11]  (part G of 7)
U4  TPS74801DRCR  [SON10_P50L32W32H10_DRC]
U13  AS1364-BTDT-AD  [TDFN8_P65L30W30H08]

### Nets
1V2: C2.1 C3.2 C4.2 C5.2 C6.2 C8.2 C9.2 C10.2 C11.2 C56.1 C94.2 C95.2 C97.2 C98.2 FB1.2 FB2.2 FB3.2 R56.1 R57.1 U1.B10(VDD8) U1.C3(VDD2) U1.E9(VDD4) U1.F11(VDD5) U1.H1(VDD1) U1.J11(VDD7) U1.L5(VDD6) U1.L7(VDD3) U13.5(OUT1) U13.6(OUT2)
3V3: C12.2 C13.2 C14.2 C15.2 C16.2 C17.2 C22.2 C23.2 C24.2 C25.2 C26.2 C27.2 C28.2 C29.2 C33.2 C34.2 C55.1 FB4.2 R14.1 R15.1 U1.B1(VIO4) U1.B6(CVDDQ) U1.C11(VIO5) U1.E3(VIO3) U1.F1(VIO2) U1.H11(VIO1_2) U1.L9(VIO1_1) U4.9(OUT1) U4.10(OUT2) U13.2(IN) U13.3(IN1) U13.4(IN2)
5V0: C7.2 C32.1 C36.1 C37.2 U1.E10(VBAT) U4.1(IN1) U4.2(IN2) U4.4(BIAS) U4.5(EN)
GND: C2.2 C3.1 C4.1 C5.1 C6.1 C7.1 C8.1 C9.1 C10.1 C11.1 C12.1 C13.1 C14.1 C15.1 C16.1 C17.1 C18.2 C19.1 C20.2 C21.1 C22.1 C23.1 C24.1 C25.1 C26.1 C27.1 C28.1 C29.1 C30.2 C31.1 C32.2 C33.1 C34.1 C36.2 C37.1 C38.1 C55.2 C56.2 C94.1 C95.1 C97.1 C98.1 H1.1 H2.1 H3.1 H4.1 R18.2 R53.2 U1.A1(U3VSSQ) U1.A8(VSS12) U1.B7(AVSS) U1.B8(U2PLLVSSQ) U1.B9(U2AFEVSSQ) U1.D8(VSS5) U1.E2(VSS3) U1.G1(VSS1) U1.G11(VSS6) U1.K3(VSS10) U1.K4(VSS8) U1.L1(VSS2) U1.L2(VSS11) U1.L3(VSS9) U1.L6(VSS4) U1.L11(VSS7) U4.6(GND) U4.11(EPAD) U13.8(GND) U13.9(PAD)
VDD3.3V: FB4.1
1V2_AVDD: C18.1 C19.2 FB1.1 U1.A7(AVDD)
1V2_U3RX: C20.1 C21.2 FB2.1 U1.A2(U3RXVDDQ)
1V2_U3TX: C30.1 C31.2 FB3.1 U1.B5(U3TXVDDQ)
NetC38_2: C38.2 U4.7(SS)
NetR14_2: R14.2 U4.3(PG)
NetR15_2: R15.2 R18.1 U4.8(FB)
NetR53_1: R53.1 R57.2 U13.7(SET/BYP)
NetR56_2: R56.2 U13.1(POK)

Not connected (* = marked no-connect by the designer): C96 1 2

### Notes on the sheet
- 22uF/16V 1206-->47uF 0805
- 4.7uF 0805-->4.7uF 0402
- c25,C28, c54-->4.7uF 0403
- (near U1) FX3  POWER
- (near H1) Mounting Hole
- (near H2) Mounting Hole
- (near H4) Mounting Hole
- (near H3) Mounting Hole
- (in symbol CYUSB3014, part G) POWER; SEC 7/7

### Library data of the parts
C2 C18 C20 C30 = cap0805: CC08052B476M5B20D; 元件类别: 贴片电容; 主物料厂家: YAGEO
C3-C17 C19 C21-C29 C31-C34 C37 C38 C94-C98 = Cap: Capacitor; Published: 8-Jun-2000; LatestRevisionDate: 17-Jul-2002; LatestRevisionNote: Re-released for DXP Platform.; PackageReference: RAD-0.3; Publisher: Altium Limited
  C3 C5-C12 C14 C15 C19 C21 C23 C24 C26 C29 C31 C33 C37: Value: 0.1uF
  C13 C16 C17 C22 C27 C94-C98: Value: 0.01uF
  C25 C28: Value: 4.7uF
  C34: Value: 10uF
  C38: Value: NC
C36 C55 C56 = cap0402: as C176 on sheet sch_Connet&IMU
H1-H4 = CON1: Connector
R14 R15 R18 R53 R56 R57 = Resistor: Published: 8-Jun-2000; LatestRevisionDate: 17-Jul-2002; LatestRevisionNote: Re-released for DXP Platform.; PackageReference: AXIAL-0.4; Publisher: Altium Limited
  R56: Value: 100K

## Sheet sch_LIMA_Driver.SchDoc
size A4
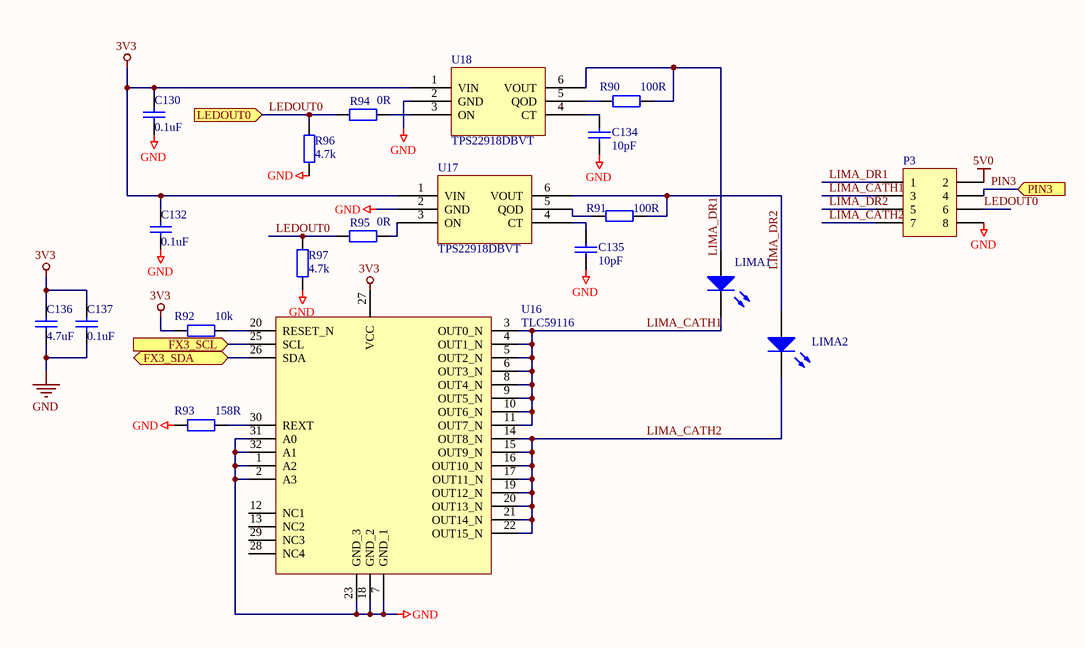
[diagram p6: sch_LIMA_Driver.SchDoc]

### Parts
C130  value 0.1uF  [0402C_L]  (hidden comment: 1uF)
C132  value 0.1uF  [0402C_L]  (hidden comment: 1uF)
C134  10pF  [0402C_L]
C135  10pF  [0402C_L]
C136  4.7uF
C137  0.1uF  [0402C]
LIMA1  LIMA  (value not drawn)
LIMA2  LIMA  (value not drawn)
P3  Header 4X2  [HDR2X4]  (value not drawn)
R90  100R  [0402R]
R91  100R  [0402R]
R92  10k  [0402R]
R93  158R  [0402R]
R94  0R  [0402R]
R95  0R  [0402R]
R96  4.7k  [0402R]
R97  4.7k  [0402R]
U16  TLC59116
U17  TPS22918DBVT
U18  TPS22918DBVT

### Ports
FX3_SCL (in), FX3_SDA (bidir), LEDOUT0 (in), PIN3 (in)

### Nets
3V3: C130.2 C132.2 C136.2 C137.2 R92.2 U16.27(VCC) U17.1(VIN) U18.1(VIN)
5V0: P3.2
GND: C130.1 C132.1 C134.1 C135.1 C136.1 C137.1 P3.8 R93.2 R96.1 R97.1 U16.1(A2) U16.2(A3) U16.7(GND_1) U16.18(GND_2) U16.23(GND_3) U16.31(A0) U16.32(A1) U17.2(GND) U18.2(GND)
FX3_SCL: U16.25(SCL) ; port FX3_SCL
FX3_SDA: U16.26(SDA) ; port FX3_SDA
LEDOUT0: P3.6 R94.2 R95.2 R96.2 R97.2 ; port LEDOUT0
LIMA_CATH1: LIMA1.2(K) P3.3 U16.3(OUT0_N) U16.4(OUT1_N) U16.5(OUT2_N) U16.6(OUT3_N) U16.8(OUT4_N) U16.9(OUT5_N) U16.10(OUT6_N) U16.11(OUT7_N)
LIMA_CATH2: LIMA2.2(K) P3.7 U16.14(OUT8_N) U16.15(OUT9_N) U16.16(OUT10_N) U16.17(OUT11_N) U16.19(OUT12_N) U16.20(OUT13_N) U16.21(OUT14_N) U16.22(OUT15_N)
LIMA_DR1: P3.1
LIMA_DR2: LIMA2.1(A) P3.5 R91.1 U17.6(VOUT)
PIN3: P3.4 ; port PIN3
NetC134_2: C134.2 U18.4(CT)
NetC135_2: C135.2 U17.4(CT)
NetLIMA1_1: LIMA1.1(A) R90.1 U18.6(VOUT)
NetR90_2: R90.2 U18.5(QOD)
NetR91_2: R91.2 U17.5(QOD)
NetR92_1: R92.1 U16.20(RESET_N)
NetR93_1: R93.1 U16.30(REXT)
NetR94_1: R94.1 U18.3(ON)
NetR95_1: R95.1 U17.3(ON)

Not connected (* = marked no-connect by the designer): U16 12(NC1) 13(NC2) 28(NC4) 29(NC3)

### Notes on the sheet
- Labels drawn without touching a wire or pin: LIMA_DR1

### Library data of the parts
C130 C132 C134 C135 = Cap: Capacitor; Published: 8-Jun-2000; LatestRevisionDate: 17-Jul-2002; LatestRevisionNote: Re-released for DXP Platform.; Publisher: Altium Limited
  C134 C135: Value: 10pF
C136 = Cap: Capacitor; Value: 0805; Published: 8-Jun-2000; LatestRevisionDate: 17-Jul-2002; LatestRevisionNote: Re-released for DXP Platform.; PackageReference: RAD-0.3; Publisher: Altium Limited
C137 = Cap: Capacitor; Value: C0402; Published: 8-Jun-2000; LatestRevisionDate: 17-Jul-2002; LatestRevisionNote: Re-released for DXP Platform.; Publisher: Altium Limited
LIMA1 LIMA2 = LED: 发光二级管
P3 = Header 4X2: Header, 4-Pin, Dual row; LatestRevisionDate: 17-Jul-2002; LatestRevisionNote: Re-released for DXP Platform.; Publisher: Altium Limited
R90-R97 = Resistor: Value: 100; Published: 8-Jun-2000; LatestRevisionDate: 17-Jul-2002; LatestRevisionNote: Re-released for DXP Platform.; PackageReference: AXIAL-0.4; Publisher: Altium Limited

## Nets that join several sheets
3V3: sch_CPU (14 pins), sch_Connet&IMU (6 pins), sch_USB3.0 (5 pins), sch_Power (32 pins), sch_LIMA_Driver (8 pins)
5V0: sch_CPU (P1.1 P2.2 R5.1), sch_Connet&IMU (C178.2 C179.2 U15.6), sch_camera (5 pins), sch_USB3.0 (C40.1 C43.2 L2.2 U1.E11), sch_Power (9 pins), sch_LIMA_Driver (P3.2)
AGND: sch_Connet&IMU (10 pins), sch_camera (12 pins)
GND: sch_CPU (19 pins), sch_Connet&IMU (36 pins), sch_camera (31 pins), sch_USB3.0 (26 pins), sch_Power (68 pins), sch_LIMA_Driver (19 pins)
VDD3.3V: sch_camera (21 pins), sch_Power (FB4.1)
AD0: sch_CPU (U1.K7), sch_Connet&IMU (R76.2 U9.4)
ADDR_CTL: sch_CPU (U1.D1), sch_camera (R98.2 U8.G7)
CAMPWR_EN: sch_CPU (U1.D3), sch_Connet&IMU (R73.2 U15.4), sch_camera (R42.1 U5.4)
CMOS_D0: sch_CPU (U1.F10), sch_camera (T4.1 U8.A7)
CMOS_D1: sch_CPU (U1.F9), sch_camera (U8.A8)
CMOS_D2: sch_CPU (U1.F7), sch_camera (U8.B7)
CMOS_D3: sch_CPU (U1.G10), sch_camera (U8.E1)
CMOS_D4: sch_CPU (U1.G9), sch_camera (U8.F1)
CMOS_D5: sch_CPU (U1.F8), sch_camera (U8.F2)
CMOS_D6: sch_CPU (U1.H10), sch_camera (U8.G1)
CMOS_D7: sch_CPU (U1.H9), sch_camera (U8.H1)
CMOS_D8: sch_CPU (U1.J10), sch_Connet&IMU (T7.1 U11.A7)
CMOS_D9: sch_CPU (U1.J9), sch_Connet&IMU (U11.A8)
CMOS_D10: sch_CPU (U1.K11), sch_Connet&IMU (U11.B7)
CMOS_D11: sch_CPU (U1.L10), sch_Connet&IMU (U11.E1)
CMOS_D12: sch_CPU (U1.K10), sch_Connet&IMU (U11.F1)
CMOS_D13: sch_CPU (U1.K9), sch_Connet&IMU (U11.F2)
CMOS_D14: sch_CPU (U1.J8), sch_Connet&IMU (U11.G1)
CMOS_D15: sch_CPU (U1.G8), sch_Connet&IMU (U11.H1)
CMOS_HD: sch_CPU (U1.J5), sch_camera (T3.1 U8.H2)
CMOS_OE: sch_CPU (U1.H7), sch_Connet&IMU (R69.2 U11.H6), sch_camera (U8.H6)
CMOS_PCLK: sch_CPU (U1.J6), sch_camera (T1.1 U8.B5)
CMOS_RST: sch_CPU (U1.K8), sch_Connet&IMU (U11.G8), sch_camera (C61.2 R23.1 U8.G8)
CMOS_VD: sch_CPU (U1.H5), sch_camera (T2.1 U8.G2)
EXPOSURE: sch_CPU (U1.K6), sch_Connet&IMU (U11.H3), sch_camera (R39.1 U8.H3)
FX3_SCL: sch_Connet&IMU (U9.2 U11.H4), sch_camera (U8.H4), sch_USB3.0 (R26.2 U1.D9), sch_LIMA_Driver (U16.25)
FX3_SDA: sch_Connet&IMU (U9.3 U11.G4), sch_camera (U8.G4), sch_USB3.0 (R25.2 U1.D10), sch_LIMA_Driver (U16.26)
G_FSYNC: sch_CPU (U1.G5), sch_Connet&IMU (U9.8)
IMU_INT: sch_CPU (U1.H8), sch_Connet&IMU (R44.1 U9.6)
LEDOUT0: sch_camera (U8.G6), sch_LIMA_Driver (5 pins)
MCLK27M: sch_Connet&IMU (U11.A5), sch_camera (R24.1)
nCS: sch_CPU (U1.J7), sch_Connet&IMU (R75.2 U9.5)
PIN3: sch_CPU (U1.H3), sch_LIMA_Driver (P3.4)
STANDBY: sch_CPU (U1.G7), sch_Connet&IMU (R77.1 U11.F8), sch_camera (U8.F8)